# EAGLE design 3V3 Reg Board (EAGLE 6.4)
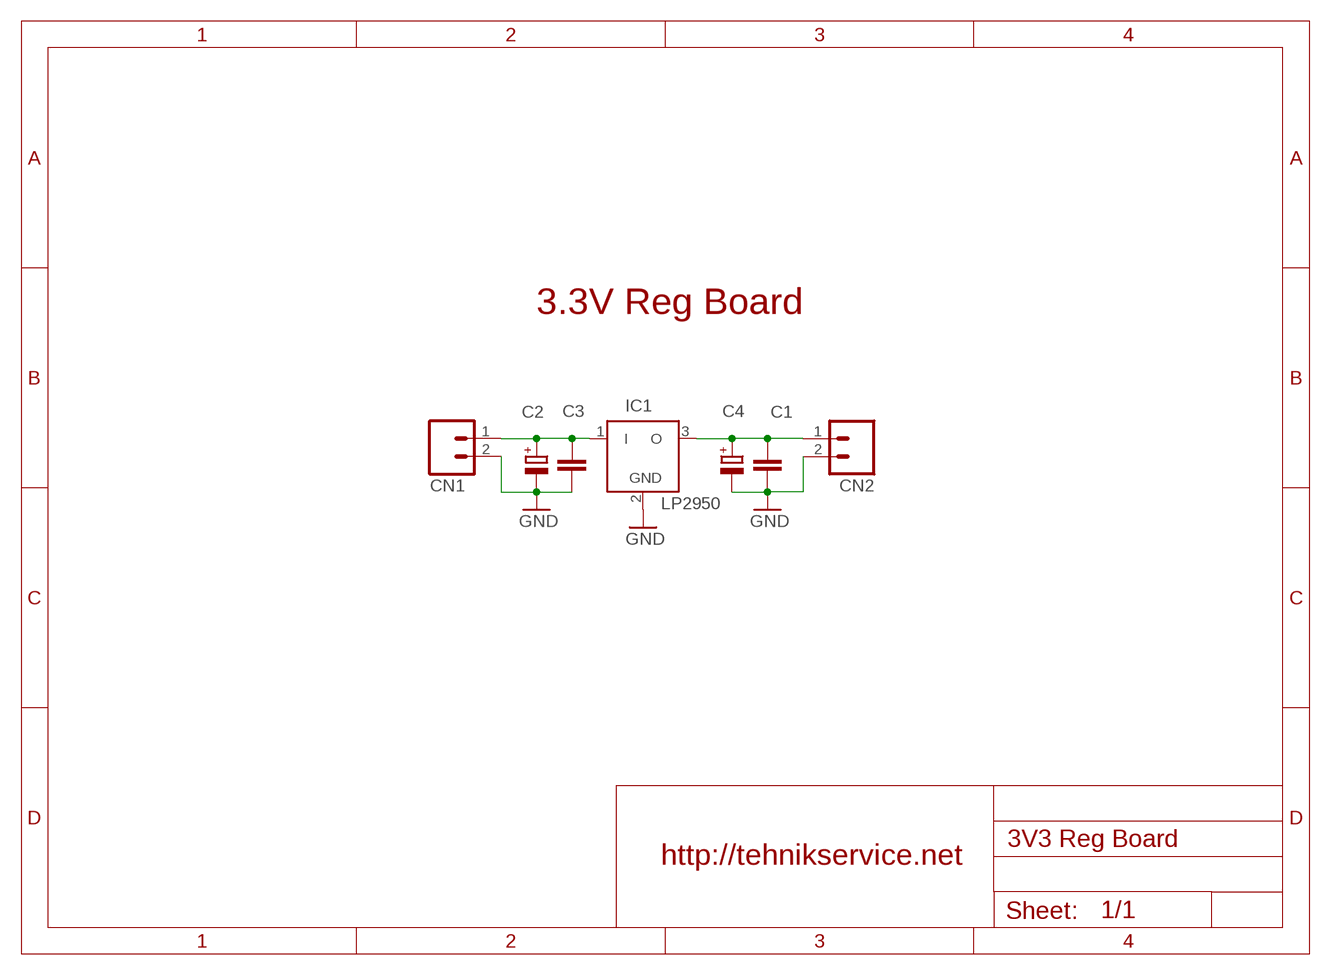
[diagram p0: schematic, sheet 1]

## Parts
C1  C-EU025-024X044  [C025-024X044]
C2  C-EU025-024X044  [C025-024X044]
C3  CPOL-EUE1.8-4  [E1,8-4]
C4  CPOL-EUE1.8-4  [E1,8-4]
CN1  M02  [02P]
CN2  M02  [02P]
IC1  LP2950  [DPACK]

## Nets
GND: C1.1 C2.1 C3.- C4.- CN1.2 CN2.2 IC1.2(GND)
N$1: C2.2 C3.+ CN1.1 IC1.1(I)
N$2: C1.2 C4.+ CN2.1 IC1.3(O)

## Notes on the sheet
- 3.3V Reg Board
- http://tehnikservice.net

## Library data of the parts
C1 C2 = rcl:C-EU: CAPACITOR, European symbol
C3 C4 = rcl:CPOL-EU: POLARIZED CAPACITOR, European symbol
CN1 CN2 = con-amp-quick:M02: AMP QUICK CONNECTOR; OC_FARNELL: unknown; OC_NEWARK: unknown
IC1 = linear:LP2950: 100 mA, Low Power Low Dropout Voltage Regulator Source: http://www.onsemi.com/pub/Collateral/LP2950-D.PDF

## Board
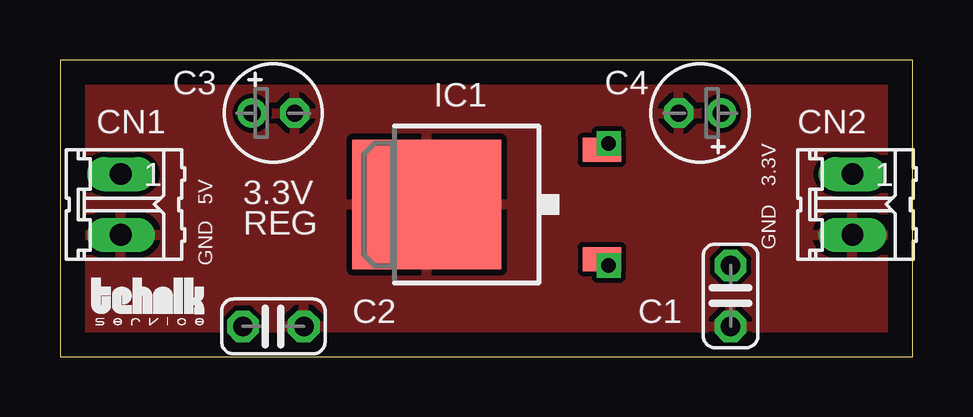
[diagram p1: board, top side]
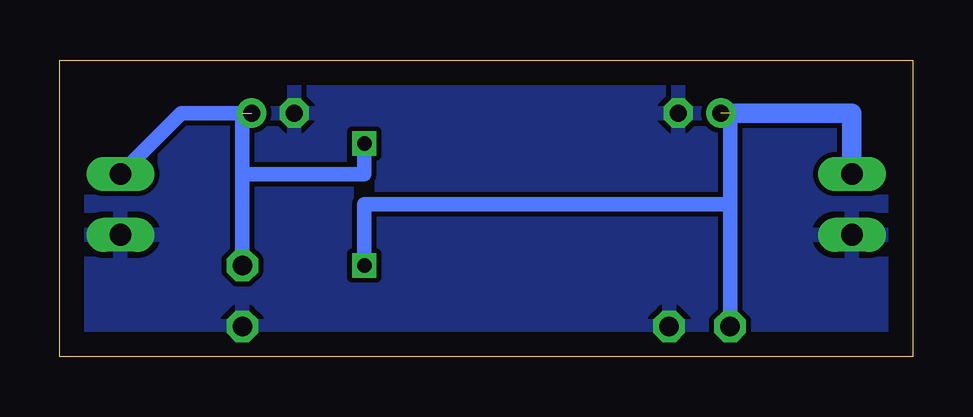
[diagram p2: board, bottom side, seen from below]

Size 35.54 x 12.37 mm. Coordinates in mm from the lower left corner, seen from the top.
Outline: 0,0 35.54,0 35.54,12.37 0,12.37 0,0
Copper layers (1*16): Top 0.035mm / dielectric 1.5mm / Bottom 0.035mm
Design rules "default": minimum track width 10mil, minimum drill 24mil, track to track 8mil, track to pad 8mil, pad to pad 8mil, via to via 8mil, smd to smd 8mil, copper to edge 40mil, drill to drill 8mil, minimum pad ring 10mil, minimum via ring 8mil, stop-mask expansion 4mil, vias tented up to drill 0mil, thermal gap 10mil

### Footprints (pad centres in the part's own frame; a part is rotated, then mirrored left to right if it is on the bottom)
C025-024X044 = drill 0.813 octagon: 1 -1.27,0; 2 1.27,0
E1,8-4 = drill 0.711 pad 1.168: + -0.889,0 | drill 0.711 pad 1.168 octagon: - 0.889,0
02P = drill 0.914 long: 1 -1.27,0; 2 1.27,0
DPACK = smd 1 x 1.6: 1 -2.28,-4.8; 3 2.28,-4.8 | smd 5.4 x 6.2: 2 0,2.5

### Placement (x,y rotation side)
C1  27.94,2.54 90 top
C2  8.89,1.27 180 top
C3  8.89,10.16 0 top
C4  26.67,10.16 180 top
CN1  2.54,6.35 270 top
CN2  33.02,6.35 270 top
IC1  17.78,6.35 90 top
U$1  [LOGOT]  1.27,1.27 0 top

### Tracks (layer width: path | path; a pad name or v marks a point on that pad's centre or on a via)
GND
  pour Top: 0,12.7 35.56,12.7 35.56,0 0,0
  pour Bottom: 0,12.7 35.56,12.7 35.56,0 0,0
N$1  (via drill 0.6)  (1 unrouted)
  Top 0.61: v22.86,3.81 22.58,3.81 IC1.1
  Bottom 0.61: C2.2 7.62,6.35 | 7.62,6.35 7.62,10.16 | v22.86,3.81 22.86,6.35 7.62,6.35
  Bottom 0.813: 7.62,10.16 2.54,10.16 CN1.1
N$2  (via drill 0.6)  (1 unrouted)
  Top 0.61: v22.86,8.89 22.58,8.89 IC1.3
  Bottom 0.61: CN2.1 30.48,10.16 27.94,10.16 27.94,7.62 | 27.94,7.62 22.86,7.62 v22.86,8.89 | C1.2 27.94,7.62

### Text on the board
tNames: 3.3V | 5V | 3.3V | GND | REG | GND